# Altium schematic sheet Power.SchDoc
size 863 x 558 mm; SheetNumber: 3; SheetTotal: 6
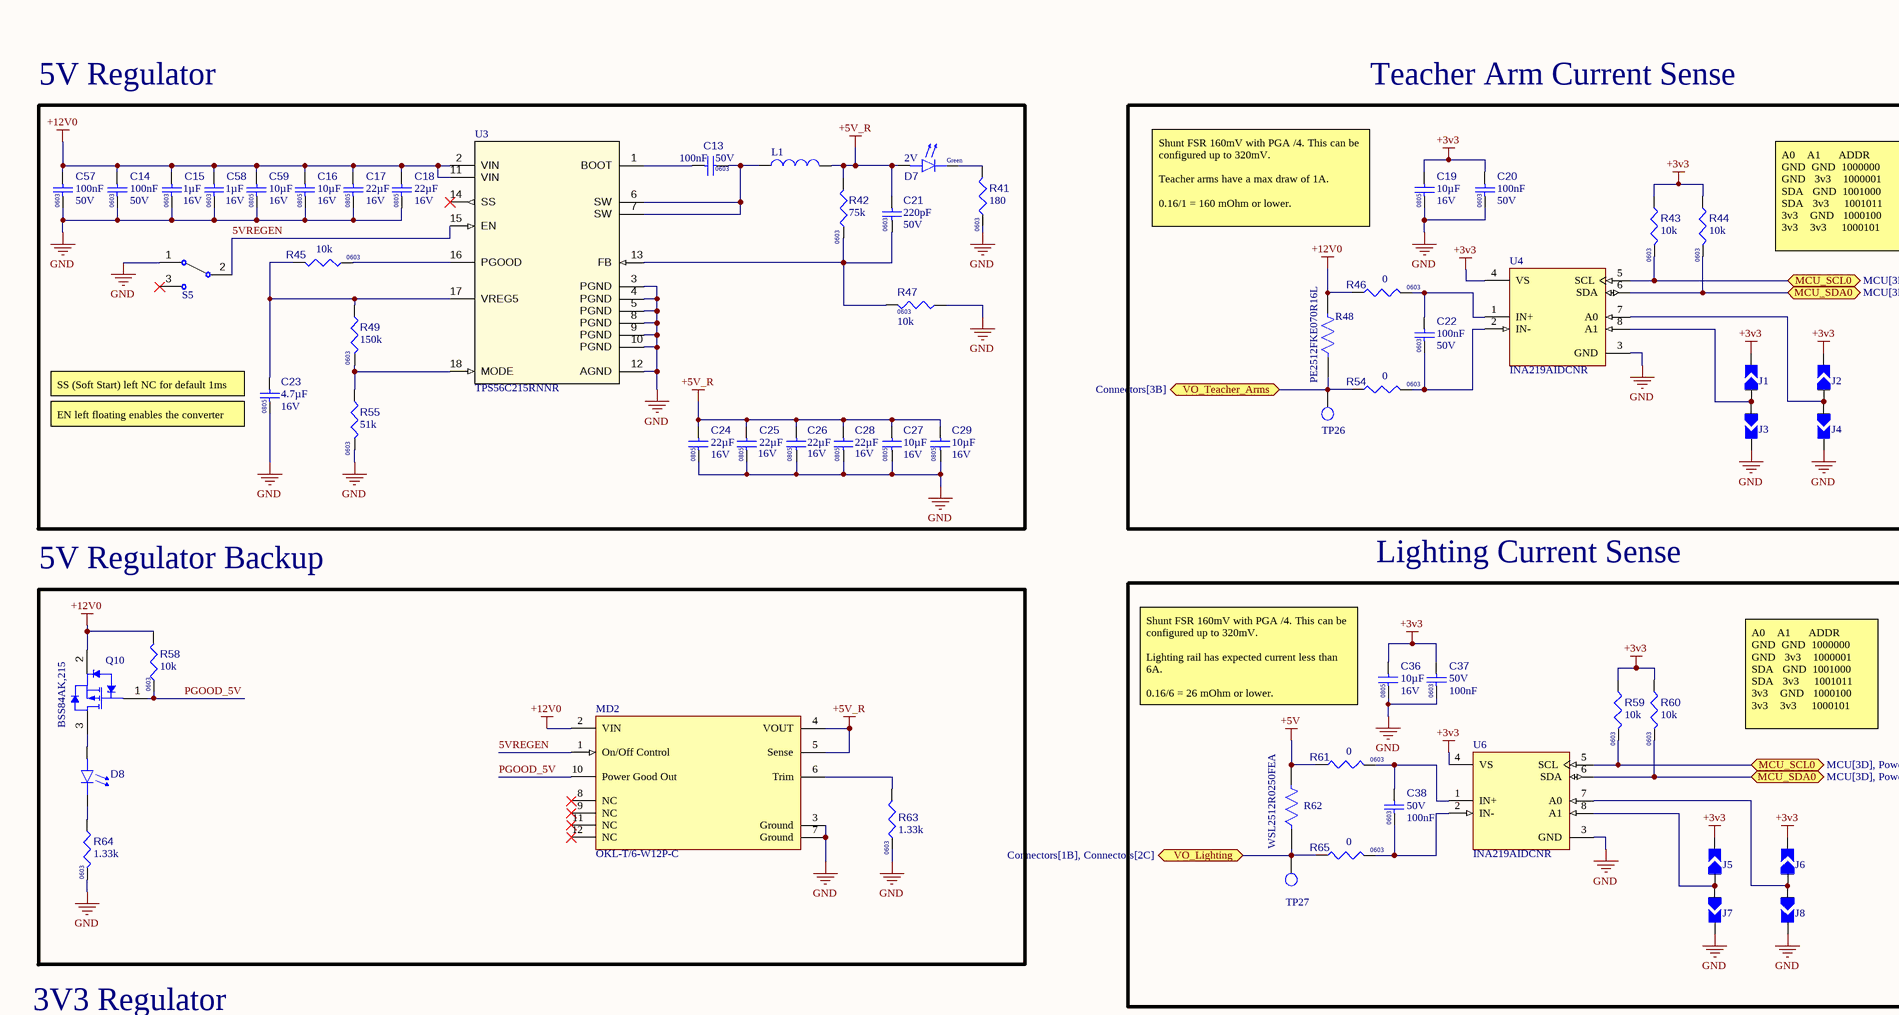
[diagram p0: Power.SchDoc, top left]
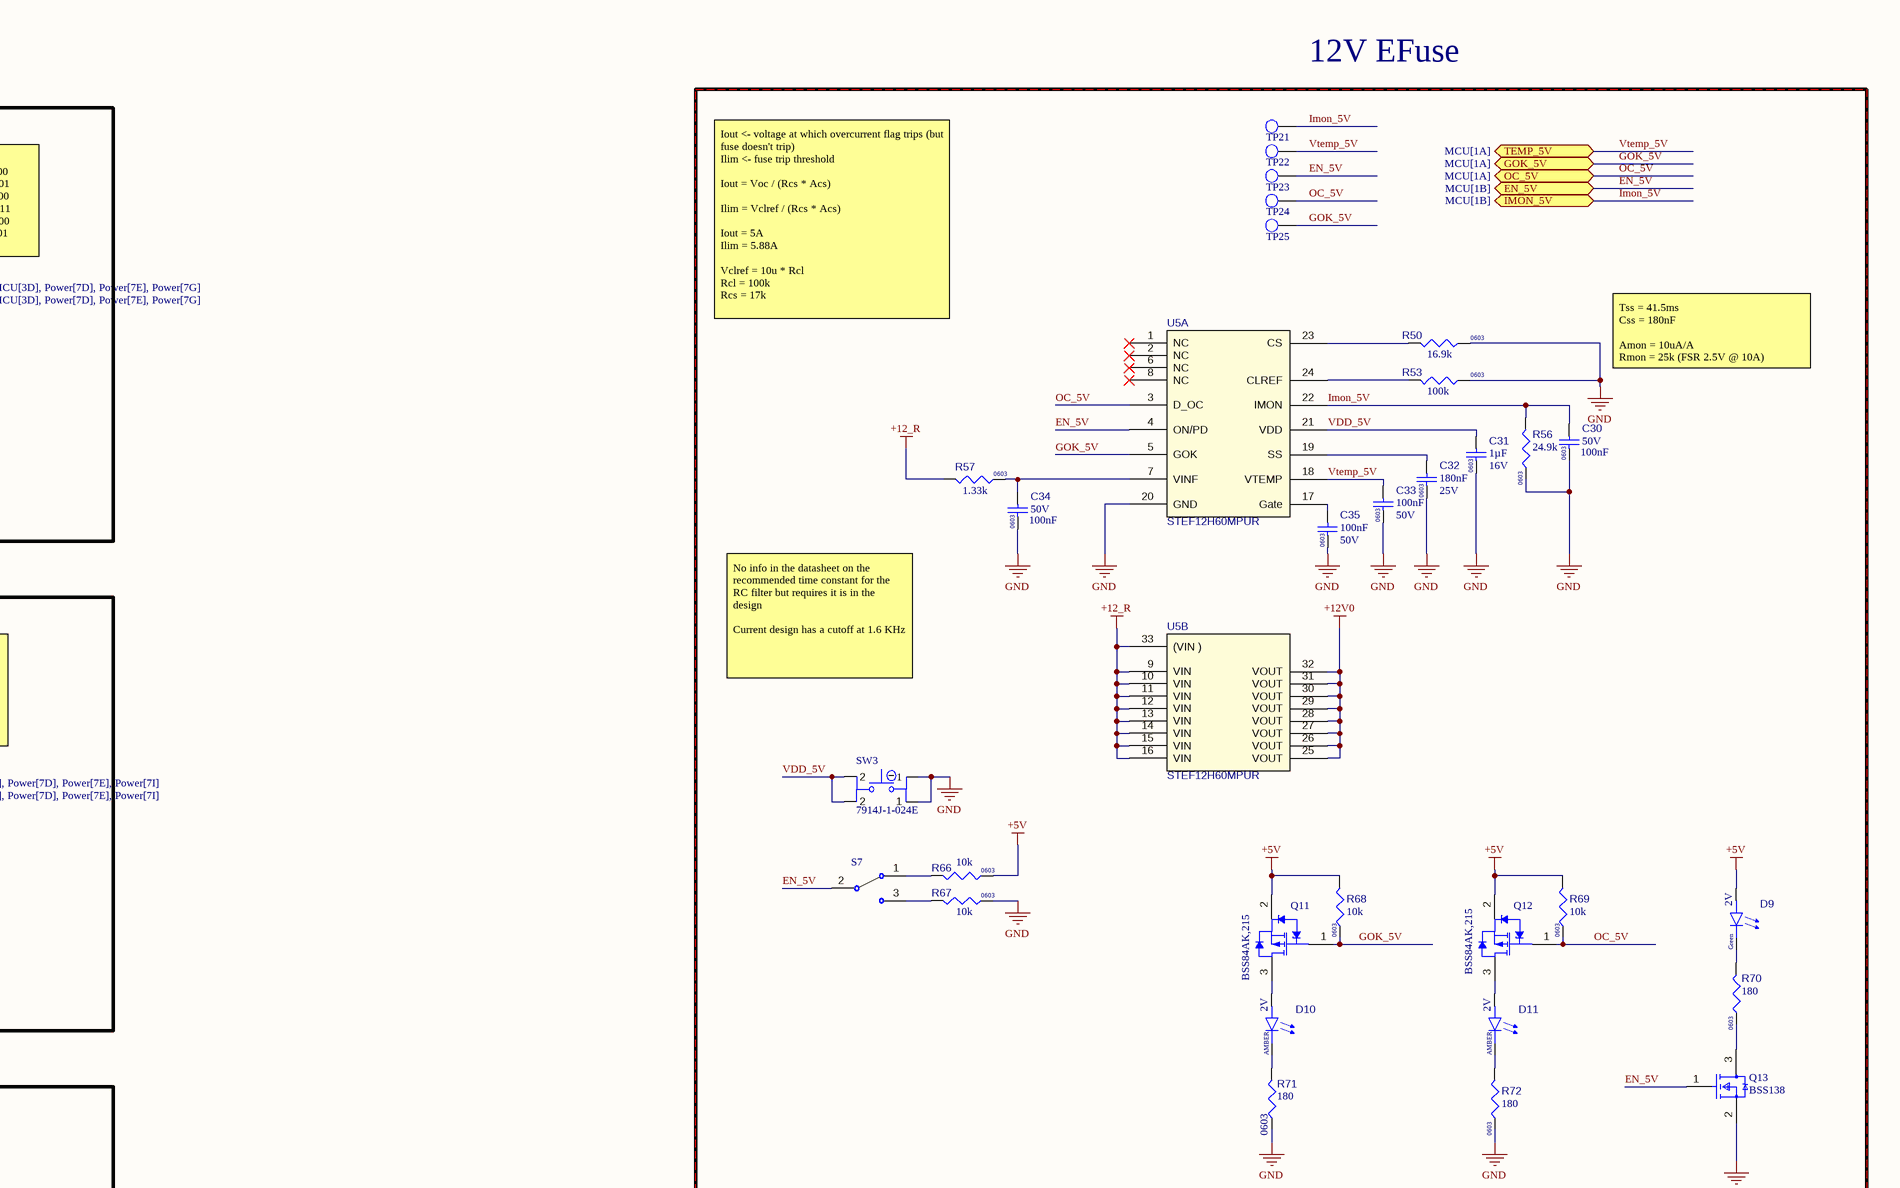
[diagram p1: Power.SchDoc, top right]
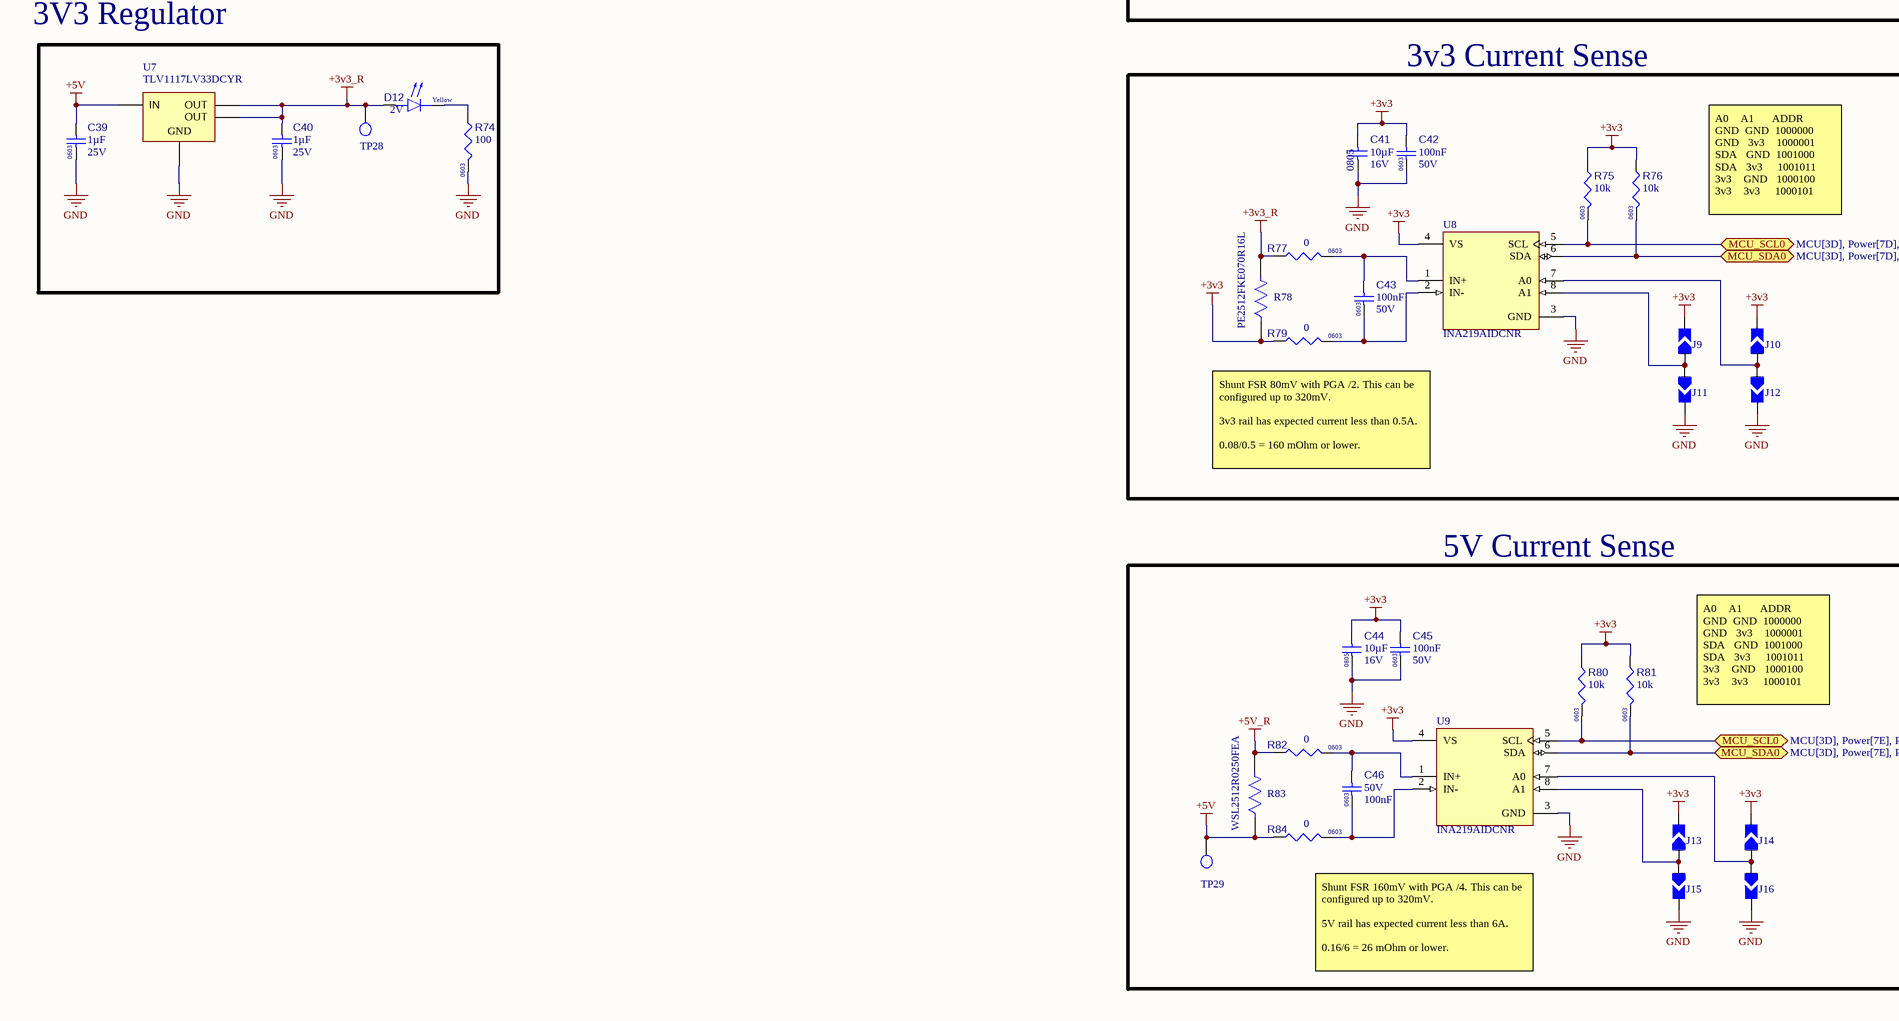
[diagram p2: Power.SchDoc, bottom left]

## Parts
C13  value 100nF  Voltage Rating: 50V  Case/Package: 0603  [CAPC1608X90X40NL10T20]  (hidden comment: Capacitor 100 nF +/-10% 50 V 0603)
C14  value 100nF  Voltage Rating: 50V  Case/Package: 0603  [CAPC1608X90X40NL10T20]  (hidden comment: Capacitor 100 nF +/-10% 50 V 0603)
C15  value 1µF  Case/Package: 0603  Voltage Rating: 16V  [CAPC1608X90X35NL15T15]  (hidden comment: Capacitor 1uF +/- 10% 16V 0603)
C16  value 10µF  Voltage Rating: 16V  Case/Package: 0805  [CAP CER 10UF 16V X5R 0805-Footprint-1]  (hidden comment: CAP CER 10UF 16V X5R 0805)
C17  value 22µF  Voltage Rating: 16V  Case/Package: 0805  [CL21A226MOQNNNE-Footprint-1]  (hidden comment: CL21A226MOQNNNE)
C18  value 22µF  Voltage Rating: 16V  Case/Package: 0805  [CL21A226MOQNNNE-Footprint-1]  (hidden comment: CL21A226MOQNNNE)
C19  value 10µF  Voltage Rating: 16V  Case/Package: 0805  [CAP CER 10UF 16V X5R 0805-Footprint-1]  (hidden comment: CAP CER 10UF 16V X5R 0805)
C20  value 100nF  Voltage Rating: 50V  Case/Package: 0603  [CAPC1608X90X40NL10T20]  (hidden comment: Capacitor 100 nF +/-10% 50 V 0603)
C21  value 220pF  Rated DC Voltage (URdc): 50V  Case/Package: 0603  [FP-CL10-IPC_B]  (hidden comment: CL10C221JB8NNNC)
C22  value 100nF  Voltage Rating: 50V  Case/Package: 0603  [CAPC1608X90X40NL10T20]  (hidden comment: Capacitor 100 nF +/-10% 50 V 0603)
C23  value 4.7µF  Case/Package: 0805  Rated DC Voltage (URdc): 16V  [CL21A475KOFNNNE-Footprint-1]  (hidden comment: CL21A475KOFNNNE)
C24  value 22µF  Voltage Rating: 16V  Case/Package: 0805  [CL21A226MOQNNNE-Footprint-1]  (hidden comment: CL21A226MOQNNNE)
C25  value 22µF  Voltage Rating: 16V  Case/Package: 0805  [CL21A226MOQNNNE-Footprint-1]  (hidden comment: CL21A226MOQNNNE)
C26  value 22µF  Voltage Rating: 16V  Case/Package: 0805  [CL21A226MOQNNNE-Footprint-1]  (hidden comment: CL21A226MOQNNNE)
C27  value 10µF  Voltage Rating: 16V  Case/Package: 0805  [CAP CER 10UF 16V X5R 0805-Footprint-1]  (hidden comment: CAP CER 10UF 16V X5R 0805)
C28  value 22µF  Voltage Rating: 16V  Case/Package: 0805  [CL21A226MOQNNNE-Footprint-1]  (hidden comment: CL21A226MOQNNNE)
C29  value 10µF  Voltage Rating: 16V  Case/Package: 0805  [CAP CER 10UF 16V X5R 0805-Footprint-1]  (hidden comment: CAP CER 10UF 16V X5R 0805)
C30  value 100nF  Voltage Rating: 50V  Case/Package: 0603  [CAPC1608X90X40NL10T20]  (hidden comment: Capacitor 100 nF +/-10% 50 V 0603)
C31  value 1µF  Case/Package: 0603  Voltage Rating: 16V  [CAPC1608X90X35NL15T15]  (hidden comment: Capacitor 1uF +/- 10% 16V 0603)
C32  value 180nF  Case/Package: 0603  Rated DC Voltage (URdc): 25V  [FP-GCM188-0_1-IPC_C]  (hidden comment: GCM188R71E184KA55D)
C33  value 100nF  Voltage Rating: 50V  Case/Package: 0603  [CAPC1608X90X40NL10T20]  (hidden comment: Capacitor 100 nF +/-10% 50 V 0603)
C34  value 100nF  Voltage Rating: 50V  Case/Package: 0603  [CAPC1608X90X40NL10T20]  (hidden comment: Capacitor 100 nF +/-10% 50 V 0603)
C35  value 100nF  Voltage Rating: 50V  Case/Package: 0603  [CAPC1608X90X40NL10T20]  (hidden comment: Capacitor 100 nF +/-10% 50 V 0603)
C36  value 10µF  Voltage Rating: 16V  Case/Package: 0805  [CAP CER 10UF 16V X5R 0805-Footprint-1]  (hidden comment: CAP CER 10UF 16V X5R 0805)
C37  value 100nF  Voltage Rating: 50V  Case/Package: 0603  [CAPC1608X90X40NL10T20]  (hidden comment: Capacitor 100 nF +/-10% 50 V 0603)
C38  value 100nF  Voltage Rating: 50V  Case/Package: 0603  [CAPC1608X90X40NL10T20]  (hidden comment: Capacitor 100 nF +/-10% 50 V 0603)
C39  value 1µF  Rated DC Voltage (URdc): 25V  Case/Package: 0603  [FP-CL10-IPC_B]  (hidden comment: CL10B105KA8NNNC)
C40  value 1µF  Rated DC Voltage (URdc): 25V  Case/Package: 0603  [FP-CL10-IPC_B]  (hidden comment: CL10B105KA8NNNC)
C41  value 10µF  Voltage Rating: 16V  Case/Package: 0805  [CAP CER 10UF 16V X5R 0805-Footprint-1]  (hidden comment: CAP CER 10UF 16V X5R 0805)
C42  value 100nF  Voltage Rating: 50V  Case/Package: 0603  [CAPC1608X90X40NL10T20]  (hidden comment: Capacitor 100 nF +/-10% 50 V 0603)
C43  value 100nF  Voltage Rating: 50V  Case/Package: 0603  [CAPC1608X90X40NL10T20]  (hidden comment: Capacitor 100 nF +/-10% 50 V 0603)
C44  value 10µF  Voltage Rating: 16V  Case/Package: 0805  [CAP CER 10UF 16V X5R 0805-Footprint-1]  (hidden comment: CAP CER 10UF 16V X5R 0805)
C45  value 100nF  Voltage Rating: 50V  Case/Package: 0603  [CAPC1608X90X40NL10T20]  (hidden comment: Capacitor 100 nF +/-10% 50 V 0603)
C46  value 100nF  Voltage Rating: 50V  Case/Package: 0603  [CAPC1608X90X40NL10T20]  (hidden comment: Capacitor 100 nF +/-10% 50 V 0603)
C57  value 100nF  Voltage Rating: 50V  Case/Package: 0603  [CAPC1608X90X40NL10T20]  (hidden comment: Capacitor 100 nF +/-10% 50 V 0603)
C58  value 1µF  Case/Package: 0603  Voltage Rating: 16V  [CAPC1608X90X35NL15T15]  (hidden comment: Capacitor 1uF +/- 10% 16V 0603)
C59  value 10µF  Voltage Rating: 16V  Case/Package: 0805  [CAP CER 10UF 16V X5R 0805-Footprint-1]  (hidden comment: CAP CER 10UF 16V X5R 0805)
D7  Forward Voltage: 2V  Color: Green  [WL-SMCW_0603_150060xx75000]  (hidden comment: 150060VS75000)
D8  150060RS75000  [WL-SMCW_0603_150060xx75000]  (value not drawn)
D9  Forward Voltage: 2V  Color: Green  [WL-SMCW_0603_150060xx75000]  (hidden comment: 150060VS75000)
D10  Forward Voltage: 2V  Colour: AMBER  [WL-SMCW_0603_150060xx75000]  (hidden comment: 150060AS75000)
D11  Forward Voltage: 2V  Colour: AMBER  [WL-SMCW_0603_150060xx75000]  (hidden comment: 150060AS75000)
D12  Forward Voltage: 2V  Color: Yellow  [WL-SMCW_0603_150060xx75000]  (hidden comment: 150060YS75000)
J1  Solder jumper  [New footprint 1]  (value not drawn)
J2  Solder jumper  [New footprint 1]  (value not drawn)
J3  Solder jumper  [New footprint 1]  (value not drawn)
J4  Solder jumper  [New footprint 1]  (value not drawn)
J5  Solder jumper  [New footprint 1]  (value not drawn)
J6  Solder jumper  [New footprint 1]  (value not drawn)
J7  Solder jumper  [New footprint 1]  (value not drawn)
J8  Solder jumper  [New footprint 1]  (value not drawn)
J9  Solder jumper  [New footprint 1]  (value not drawn)
J10  Solder jumper  [New footprint 1]  (value not drawn)
J11  Solder jumper  [New footprint 1]  (value not drawn)
J12  Solder jumper  [New footprint 1]  (value not drawn)
J13  Solder jumper  [New footprint 1]  (value not drawn)
J14  Solder jumper  [New footprint 1]  (value not drawn)
J15  Solder jumper  [New footprint 1]  (value not drawn)
J16  Solder jumper  [New footprint 1]  (value not drawn)
L1  744325330  [WE-HCI_1050]  (value not drawn)
MD2  OKL-T/6-W12P-C  [FP-OKL-T-6-W12-MFG]
Q10  BSS84AK,215  [NXP-SOT23_N]
Q11  BSS84AK,215  [NXP-SOT23_N]
Q12  BSS84AK,215  [NXP-SOT23_N]
Q13  BSS138  [FP-318-08-IPC_B]
R41  value 180  Case/Package: 0603  [RESC0603(1608)_N]  (hidden comment: RC0603JR-07180RL)
R42  value 75k  Case/Package: 0603  [RC0603JR-0720KL-Footprint-1]  (hidden comment: RC0603FR-0775KL)
R43  value 10k  Case/Package: 0603  [RESC1608X55X25NL10T15]  (hidden comment: Resistor 10k +/-1% 0603 100 mW)
R44  value 10k  Case/Package: 0603  [RESC1608X55X25NL10T15]  (hidden comment: Resistor 10k +/-1% 0603 100 mW)
R45  value 10k  Case/Package: 0603  [RESC1608X55X25NL10T15]  (hidden comment: Resistor 10k +/-1% 0603 100 mW)
R46  value 0  Case/Package: 0603  [RC0603JR-0720KL-Footprint-1]  (hidden comment: RC0603JR-070RL)
R47  value 10k  Case/Package: 0603  [RESC1608X55X25NL10T15]  (hidden comment: Resistor 10k +/-1% 0603 100 mW)
R48  PE2512FKE070R16L  [FP-WSL2512-0_762-IPC_B]
R49  value 150k  Case/Package: 0603  [RC0603JR-0720KL-Footprint-1]  (hidden comment: RC0603FR-13150KL)
R50  value 16.9k  Case/Package: 0603  [RESC1608X55X25NL10T15]  (hidden comment: RC0603FR-0716K9L)
R53  value 100k  Case/Package: 0603  [RESC1608X55X25NL10T15]  (hidden comment: RC0603FR-07100KL)
R54  value 0  Case/Package: 0603  [RC0603JR-0720KL-Footprint-1]  (hidden comment: RC0603JR-070RL)
R55  value 51k  Case/Package: 0603  [RC0603JR-0720KL-Footprint-1]  (hidden comment: RC0603FR-0751KL)
R56  value 24.9k  Case/Package: 0603  [RESC1608X55X25NL10T15]  (hidden comment: RC0603FR-1024K9L)
R57  value 1.33k  Case/Package: 0603  [RESC1608X55X25NL10T15]  (hidden comment: RC0603FR-071K33L)
R58  value 10k  Case/Package: 0603  [RESC1608X55X25NL10T15]  (hidden comment: Resistor 10k +/-1% 0603 100 mW)
R59  value 10k  Case/Package: 0603  [RESC1608X55X25NL10T15]  (hidden comment: Resistor 10k +/-1% 0603 100 mW)
R60  value 10k  Case/Package: 0603  [RESC1608X55X25NL10T15]  (hidden comment: Resistor 10k +/-1% 0603 100 mW)
R61  value 0  Case/Package: 0603  [RC0603JR-0720KL-Footprint-1]  (hidden comment: RC0603JR-070RL)
R62  WSL2512R0250FEA  [FP-WSL2512-0_762-IPC_B]
R63  value 1.33k  Case/Package: 0603  [RESC1608X55X25NL10T15]  (hidden comment: RC0603FR-071K33L)
R64  value 1.33k  Case/Package: 0603  [RESC1608X55X25NL10T15]  (hidden comment: RC0603FR-071K33L)
R65  value 0  Case/Package: 0603  [RC0603JR-0720KL-Footprint-1]  (hidden comment: RC0603JR-070RL)
R66  value 10k  Case/Package: 0603  [RESC1608X55X25NL10T15]  (hidden comment: Resistor 10k +/-1% 0603 100 mW)
R67  value 10k  Case/Package: 0603  [RESC1608X55X25NL10T15]  (hidden comment: Resistor 10k +/-1% 0603 100 mW)
R68  value 10k  Case/Package: 0603  [RESC1608X55X25NL10T15]  (hidden comment: Resistor 10k +/-1% 0603 100 mW)
R69  value 10k  Case/Package: 0603  [RESC1608X55X25NL10T15]  (hidden comment: Resistor 10k +/-1% 0603 100 mW)
R70  value 180  Case/Package: 0603  [RESC0603(1608)_N]  (hidden comment: RC0603JR-07180RL)
R71  value 180  Case/Package: 0603  [RESC0603(1608)_N]  (hidden comment: RC0603JR-07180RL)
R72  value 180  Case/Package: 0603  [RESC0603(1608)_N]  (hidden comment: RC0603JR-07180RL)
R74  value 100  Case/Package: 0603  [RC0603JR-0720KL-Footprint-1]  (hidden comment: RC0603FR-07100RL)
R75  value 10k  Case/Package: 0603  [RESC1608X55X25NL10T15]  (hidden comment: Resistor 10k +/-1% 0603 100 mW)
R76  value 10k  Case/Package: 0603  [RESC1608X55X25NL10T15]  (hidden comment: Resistor 10k +/-1% 0603 100 mW)
R77  value 0  Case/Package: 0603  [RC0603JR-0720KL-Footprint-1]  (hidden comment: RC0603JR-070RL)
R78  PE2512FKE070R16L  [FP-WSL2512-0_762-IPC_B]
R79  value 0  Case/Package: 0603  [RC0603JR-0720KL-Footprint-1]  (hidden comment: RC0603JR-070RL)
R80  value 10k  Case/Package: 0603  [RESC1608X55X25NL10T15]  (hidden comment: Resistor 10k +/-1% 0603 100 mW)
R81  value 10k  Case/Package: 0603  [RESC1608X55X25NL10T15]  (hidden comment: Resistor 10k +/-1% 0603 100 mW)
R82  value 0  Case/Package: 0603  [RC0603JR-0720KL-Footprint-1]  (hidden comment: RC0603JR-070RL)
R83  WSL2512R0250FEA  [FP-WSL2512-0_762-IPC_B]
R84  value 0  Case/Package: 0603  [RC0603JR-0720KL-Footprint-1]  (hidden comment: RC0603JR-070RL)
S5  SLW-883935-2A-D  [SLW-883935-2A-D-Footprint-1]  (value not drawn)
S7  SLW-883935-2A-D  [SLW-883935-2A-D-Footprint-1]  (value not drawn)
SW3  7914J-1-024E  [FP-7914J-1-024E-MFG]
TP21  RCUCTE  [FP-S2761-46R-MFG]  (value not drawn)
TP22  RCUCTE  [FP-S2761-46R-MFG]  (value not drawn)
TP23  RCUCTE  [FP-S2761-46R-MFG]  (value not drawn)
TP24  RCUCTE  [FP-S2761-46R-MFG]  (value not drawn)
TP25  RCUCTE  [FP-S2761-46R-MFG]  (value not drawn)
TP26  RCUCTE  [FP-S2761-46R-MFG]  (value not drawn)
TP27  RCUCTE  [FP-S2761-46R-MFG]  (value not drawn)
TP28  RCUCTE  [FP-S2761-46R-MFG]  (value not drawn)
TP29  RCUCTE  [FP-S2761-46R-MFG]  (value not drawn)
U3  TPS56C215RNNR  [TPS56C215RNNR-Footprint-1]
U4  INA219AIDCNR  [FP-DCN0008A-IPC_B]
U5  STEF12H60MPUR  [STEF12H60MPUR-Footprint-1]  (parts A,B of 2)
U6  INA219AIDCNR  [FP-DCN0008A-IPC_B]
U7  TLV1117LV33DCYR  [DCY0004A_L]
U8  INA219AIDCNR  [FP-DCN0008A-IPC_B]
U9  INA219AIDCNR  [FP-DCN0008A-IPC_B]

## Blocks framed on the sheet
5V Regulator: C13-C18 C21 C23-C29 C57-C59 D7 L1 R41 R42 R45 R47 R49 R55 S5 U3
Teacher Arm Current Sense: C19 C20 C22 J1-J4 R43 R44 R46 R48 R54 TP26 U4
5V Regulator Backup: D8 MD2 Q10 R58 R63 R64
Lighting Current Sense: C36-C38 J5-J8 R59-R62 R65 TP27 U6
3v3 Current Sense: C41-C43 J9-J12 R75-R79 U8
5V Current Sense: C44-C46 J13-J16 R80-R84 TP29 U9

## Ports
EN_5V (bidir, see MCU[1B]), GOK_5V (bidir, see MCU[1A]), IMON_5V (bidir, see MCU[1B]), MCU_SCL0 (bidir, see MCU[3D], Power[7D], Power[7E], Power[7G]), MCU_SCL0 (bidir, see MCU[3D], Power[7D], Power[7E], Power[7I]), MCU_SCL0 (bidir, see MCU[3D], Power[7D], Power[7G], Power[7I]), MCU_SCL0 (bidir, see MCU[3D], Power[7E], Power[7G], Power[7I]), MCU_SDA0 (bidir, see MCU[3D], Power[7D], Power[7E], Power[7G]), MCU_SDA0 (bidir, see MCU[3D], Power[7D], Power[7E], Power[7I]), MCU_SDA0 (bidir, see MCU[3D], Power[7D], Power[7G], Power[7I]), MCU_SDA0 (bidir, see MCU[3D], Power[7E], Power[7G], Power[7I]), OC_5V (bidir, see MCU[1A]), TEMP_5V (bidir, see MCU[1A]), VO_Lighting (bidir, see Connectors[1B], Connectors[2C]), VO_Teacher_Arms (bidir, see Connectors[3B])

## Nets
+3v3: C19.2 C20.2 C36.2 C37.2 C41.2 C42.2 C44.2 C45.2 J1.2 J2.2 J5.2 J6.2 J9.2 J10.2 J13.2 J14.2 R43.1 R44.1 R59.1 R60.1 R75.1 R76.1 R78.1 R79.1 R80.1 R81.1 U4.4(VS) U6.4(VS) U8.4(VS) U9.4(VS)
+3v3_R: C40.2 D12.2(A) R77.1 R78.2 TP28.1 U7.2(OUT) U7.4(OUT)
+5V: C39.2 D9.2(A) Q11.2(S) Q12.2(S) R61.1 R62.2 R66.2 R68.2 R69.2 R83.1 R84.1 TP29.1 U7.3(IN)
+5V_R: C21.2 C24.2 C25.2 C26.2 C27.2 C28.2 C29.2 D7.2(A) L1.2 MD2.4(VOUT) MD2.5(Sense) R42.2 R82.1 R83.2
+12_R: R57.2 U5.9(VIN) U5.10(VIN) U5.11(VIN) U5.12(VIN) U5.13(VIN) U5.14(VIN) U5.15(VIN) U5.16(VIN) U5.33((VIN_))
+12V0: C14.2 C15.2 C16.2 C17.2 C18.2 C57.2 C58.2 C59.2 MD2.2(VIN) Q10.2(S) R46.1 R48.2 R58.2 U3.2(VIN) U3.11(VIN) U5.25(VOUT) U5.26(VOUT) U5.27(VOUT) U5.28(VOUT) U5.29(VOUT) U5.30(VOUT) U5.31(VOUT) U5.32(VOUT)
GND: C14.1 C15.1 C16.1 C17.1 C18.1 C19.1 C20.1 C23.1 C24.1 C25.1 C26.1 C27.1 C28.1 C29.1 C30.1 C31.1 C32.1 C33.1 C34.1 C35.1 C36.1 C37.1 C39.1 C40.1 C41.1 C42.1 C44.1 C45.1 C57.1 C58.1 C59.1 J3.2 J4.2 J7.2 J8.2 J11.2 J12.2 J15.2 J16.2 MD2.3(Ground) MD2.7(Ground) Q13.2(S) R41.1 R47.1 R50.1 R53.1 R55.2 R56.1 R63.1 R64.2 R67.1 R71.1 R72.1 R74.2 S5.1(NC) SW3.1 SW3.4(1) U3.3(PGND) U3.4(PGND) U3.5(PGND) U3.8(PGND) U3.9(PGND) U3.10(PGND) U3.12(AGND) U4.3(GND) U5.20(GND) U6.3(GND) U7.1(GND) U8.3(GND) U9.3(GND)
5VREGEN: MD2.1(On/Off_Control) S5.2(COM) U3.15(EN)
EN_5V: Q13.1(G) S7.2(COM) TP23.1 U5.4(ON/PD) ; port EN_5V
GOK_5V: Q11.1(G) R68.1 TP25.1 U5.5(GOK) ; port GOK_5V
Imon_5V: C30.2 R56.2 TP21.1 U5.22(IMON) ; port IMON_5V
MCU_SCL0: R43.2 R59.2 R75.2 R80.2 U4.5(SCL) U6.5(SCL) U8.5(SCL) U9.5(SCL) ; port MCU_SCL0
MCU_SDA0: R44.2 R60.2 R76.2 R81.2 U4.6(SDA) U6.6(SDA) U8.6(SDA) U9.6(SDA) ; port MCU_SDA0
OC_5V: Q12.1(G) R69.1 TP24.1 U5.3(D_OC) ; port OC_5V
PGOOD_5V: MD2.10(Power_Good_Out) Q10.1(G) R58.1
VDD_5V: C31.2 SW3.2 SW3.3(2) U5.21(VDD)
VO_Lighting: R62.1 R65.1 TP27.1 ; port VO_Lighting
VO_Teacher_Arms: R48.1 R54.1 TP26.1 ; port VO_Teacher_Arms
Vtemp_5V: C33.2 TP22.1 U5.18(VTEMP) ; port TEMP_5V
NetC13_1: C13.1 L1.1 U3.6(SW) U3.7(SW)
NetC13_2: C13.2 U3.1(BOOT)
NetC21_1: C21.1 R42.1 R47.2 U3.13(FB)
NetC22_1: C22.1 R54.2 U4.2(IN-)
NetC22_2: C22.2 R46.2 U4.1(IN+)
NetC23_2: C23.2 R45.2 R49.1 U3.17(VREG5)
NetC32_2: C32.2 U5.19(SS)
NetC34_2: C34.2 R57.1 U5.7(VINF)
NetC35_2: C35.2 U5.17(Gate)
NetC38_1: C38.1 R65.2 U6.2(IN-)
NetC38_2: C38.2 R61.2 U6.1(IN+)
NetC43_1: C43.1 R79.2 U8.2(IN-)
NetC43_2: C43.2 R77.2 U8.1(IN+)
NetC46_1: C46.1 R84.2 U9.2(IN-)
NetC46_2: C46.2 R82.2 U9.1(IN+)
NetD7_1: D7.1(K) R41.2
NetD8_1: D8.1(K) R64.1
NetD8_2: D8.2(A) Q10.3(D)
NetD9_1: D9.1(K) R70.2
NetD10_1: D10.1(K) R71.2
NetD10_2: D10.2(A) Q11.3(D)
NetD11_1: D11.1(K) R72.2
NetD11_2: D11.2(A) Q12.3(D)
NetD12_1: D12.1(K) R74.1
NetJ1_1: J1.1 J3.1 U4.8(A1)
NetJ2_1: J2.1 J4.1 U4.7(A0)
NetJ5_1: J5.1 J7.1 U6.8(A1)
NetJ6_1: J6.1 J8.1 U6.7(A0)
NetJ9_1: J9.1 J11.1 U8.8(A1)
NetJ10_1: J10.1 J12.1 U8.7(A0)
NetJ13_1: J13.1 J15.1 U9.8(A1)
NetJ14_1: J14.1 J16.1 U9.7(A0)
NetMD2_6: MD2.6(Trim) R63.2
NetQ13_3: Q13.3(D) R70.1
NetR45_1: R45.1 U3.16(PGOOD)
NetR49_2: R49.2 R55.1 U3.18(MODE)
NetR50_2: R50.2 U5.23(CS)
NetR53_2: R53.2 U5.24(CLREF)
NetR66_1: R66.1 S7.1(NC)
NetR67_2: R67.2 S7.3(NO)

Not connected (* = marked no-connect by the designer): MD2 8(NC)* 9(NC)* 11(NC)* 12(NC)*; S5 3(NO)*; U3 14(SS)*; U5 1(NC)* 2(NC)* 6(NC)* 8(NC)*

## Layout directives
mark named EFUSE_12V: +5V, +12_R, +12V0, EN_5V, GND, GOK_5V, Imon_5V, OC_5V, VDD_5V, Vtemp_5V

## Notes on the sheet
- 12V EFuse
- Shunt FSR 160mV with PGA /4. This can be configured up to 320mV.
  Teacher arms have a max draw of 1A.
  0.16/1 = 160 mOhm or lower.
- A0    A1      ADDR
  GND  GND  1000000
  GND   3v3    1000001
  SDA   GND  1001000
  SDA   3v3     1001011
  3v3    GND   1000100
  3v3    3v3     1000101
- Iout <- voltage at which overcurrent flag trips (but fuse doesn't trip)
  Ilim <- fuse trip threshold
  Iout = Voc / (Rcs * Acs)
  Ilim = Vclref / (Rcs * Acs)
  Iout = 5A
  Ilim = 5.88A
  Vclref = 10u * Rcl
  Rcl = 100k
  Rcs = 17k
- (near C23) SS (Soft Start) left NC for default 1ms
- Tss = 41.5ms
  Css = 180nF
  Amon = 10uA/A
  Rmon = 25k (FSR 2.5V @ 10A)
- (near C23) EN left floating enables the converter
- (near C36) Shunt FSR 160mV with PGA /4. This can be configured up to 320mV.
  Lighting rail has expected current less than 6A.
  0.16/6 = 26 mOhm or lower.
- No info in the datasheet on the recommended time constant for the RC filter but requires it is in the design
  Current design has a cutoff at 1.6 KHz
- 3V3 Regulator
- (near R79) Shunt FSR 80mV with PGA /2. This can be configured up to 320mV.
  3v3 rail has expected current less than 0.5A.
  0.08/0.5 = 160 mOhm or lower.
- (near R84) Shunt FSR 160mV with PGA /4. This can be configured up to 320mV.
  5V rail has expected current less than 6A.
  0.16/6 = 26 mOhm or lower.
- DWG. NO.
- REV.
- SHT.
- REVISION
- DESCRIPTION
- DATE
- APPROVED
- THIS DOCUMENT AND THE DATA DISCLOSED HEREIN OR HEREWITH IS THE PROPERTY OF ALTIUM LIMITED AND MAY BE FREELY DISTRIBUTED IN WHOLE. NO RIGHTS ARE RESERVED OR EXPRESS OR IMPLIED WARANTEE GIVEN.
- ENG:
- DSN:
- APPROVALS
- PROJECT
- DOCUMENT REVISION:
- DESIGN ITEM:
- CHK:
- BOM:
- REFERENCE DOCUMENTS
- PROJECT REVISION:
- TITLE
- FAB DWG:
- PCB DWG:
- ASSY DWG:
- SCALE:
- SIZE
- D
- CAGE CODE
- FILE NAME
- DWG NO.
- SHEET
- OF
- REV

## Library data of the parts
C13 C14 C20 C22 C30 C33-C35 C37 C38 C42 C43 C45 C46 C57 = CMP-001-00017-8: Chip Capacitor, 100 nF, +/- 10%, 50 V, 0603 (1608 Metric); Capacitor Type: Ceramic; Tolerance: 10%; Mounting Technology: SM; Max Operating Temperature: 125°C; RoHS Compliant: True; Pins: 2; Min Operating Temperature: -55°C
C15 C31 C58 = CMP-001-00004-8: Chip Capacitor, 1 uF, +/- 10%, 16 V, 0603 (1608 Metric); Capacitor Type: Ceramic; Mounting Technology: SM; RoHS Compliant: True; Min Operating Temperature: -55°C; Pins: 2; Max Operating Temperature: 125°C; Tolerance: 10%
C16 C19 C27 C29 C36 C41 C44 C59 = CMP-001-00084-6: Ceramic Capacitor, Multilayer, Ceramic, 16V, 10% +Tol, 10% -Tol, X5R, 15% TC, 10uF, Surface Mount, 0805; Pins: 2; Capacitor Type: Ceramic; Max Operating Temperature: 85°C; Min Operating Temperature: -55°C; RoHS Compliant: Yes; Mounting Technology: Surface Mount
C17 C18 C24-C26 C28 = CMP-001-00087-3: Ceramic Capacitor, Multilayer, Ceramic, 16V, 20% +Tol, 20% -Tol, X5R, 15% TC, 22uF, Surface Mount, 0805; Min Operating Temperature: -55°C; Mounting Technology: Surface Mount; Max Operating Temperature: 85°C; Capacitor Type: Ceramic; Pins: 2; RoHS Compliant: Yes
C21 = CMP-001-00090-1: Ceramic Capacitor, Multilayer, Ceramic, 50V, 5% +Tol, 5% -Tol, C0G, -/+30ppm/Cel TC, 0.00022uF, Surface Mount, 0603; Multilayer: Yes; Width: 0.8mm; Min Operating Temperature: -55°C; Package Shape: Rectangular; RoHS Compliant: Yes; Pins: 2; Capacitor Type: Ceramic; Length: 1.6mm; Reach SVHC Compliant: Yes; Tolerance (fill in as +-): 5%; Dielectric Material: Ceramic; Max Operating Temperature: 125°C; Packaging: Tape and Reel; JESD-609 Code: e3; Termination: Wraparound; Terminal Finish: Nickel; Package Style: SMTMeter; Temperature Characteristics Code: C0G; Tolerance  (fill in as +-): 5%; Height: 0.9mm; Mounting Technology: Surface Mount
C23 = CMP-001-00089-2: Ceramic Capacitor, Multilayer, Ceramic, 16V, 10% +Tol, 10% -Tol, X5R, 15% TC, 4.7uF, Surface Mount, 0805; Multilayer: Yes; Dielectric Material: Ceramic; Tolerance (fill in as +-): 10%; Pins: 2; Package Style: SMTMeter; Max Operating Temperature: 85°C; JESD-609 Code: e3; Termination: Wraparound; Min Operating Temperature: -55°C; RoHS Compliant: Yes; Mounting Technology: Surface Mount; Reach SVHC Compliant: Yes; Terminal Finish: Nickel; Packaging: Tape and Reel; Capacitor Type: Ceramic; Height: 1.35mm; Width: 1.25mm; Temperature Characteristics Code: X5R; Length: 2mm; Tolerance  (fill in as +-): 10%; Package Shape: Rectangular
C32 = CMP-001-00098-1: Ceramic Capacitor, Multilayer, Ceramic, 25V, 10% +Tol, 10% -Tol, X7R, 15% TC, 0.18uF, Surface Mount, 0603; Reference Standard: AEC-Q200; Multilayer: Yes; Tolerance  (fill in as +-): 10%; JESD-609 Code: e3; Dielectric Material: Ceramic; RoHS Compliant: Yes; Terminal Finish: Nickel; Capacitor Type: Ceramic; Max Operating Temperature: 125°C; Temperature Characteristics Code: X7R; Tolerance (fill in as +-): 10%; Pins: 2; Min Operating Temperature: -55°C; Height: 0.8mm; Packaging: Tape and Reel; Mounting Technology: Surface Mount; Package Shape: Rectangular; Width: 0.8mm; Package Style: SMTMeter; Reach SVHC Compliant: Yes; Termination: Wraparound; Length: 1.6mm
C39 C40 = CMP-001-00088-1: Ceramic Capacitor, Multilayer, Ceramic, 25V, 10% +Tol, 10% -Tol, X7R, 15% TC, 1uF, Surface Mount, 0603; Multilayer: Yes; RoHS Compliant: Yes; Length: 1.6mm; Packaging: Tape and Reel; Capacitor Type: Ceramic; Width: 0.8mm; Min Operating Temperature: -55°C; Termination: Wraparound; Tolerance (fill in as +-): 10%; JESD-609 Code: e3; Package Style: SMTMeter; Dielectric Material: Ceramic; Temperature Characteristics Code: X7R; Pins: 2; Reach SVHC Compliant: Yes; Mounting Technology: Surface Mount; Height: 0.9mm; Terminal Finish: Nickel; Package Shape: Rectangular; Tolerance  (fill in as +-): 10%; Max Operating Temperature: 125°C
D7 D9 = CMP-007-00045-1: Single Color LED, Bright Green, Water Clear, 1.1mm; Viewing Angle: 140°; Shape: Rectangular; Overall Height: 0.7mm; Forward Current: 30mA; Channels: 1; Luminous Intensity-Nom: 40mcd; Size: 1.1mm; Pins: 2; Optoelectronic Device Type: SINGLE COLOR LED; Mounting Technology: Surface Mount; Min Operating Temperature: -40°C; RoHS Compliant: Yes; Lens Style: WATER CLEAR; Max Operating Temperature: 85°C; Reach SVHC Compliant: Yes; Packaging: Tape and Reel; Terminal Pitch: 1.6mm
D8 = CMP-007-00036-1: Single Color LED, Red, Water Clear, 1.1mm; Forward Current: 30mA; Max Operating Temperature: 85°C; Mounting Technology: Surface Mount; RoHS Compliant: Yes; Pins: 2; Min Operating Temperature: -40°C
D10 D11 = CMP-007-00044-3: Single Color LED, Amber, Water Clear, 1.1mm; Overall Height: 0.7mm; Viewing Angle: 140°; Channels: 1; Luminous Intensity-Nom: 430mcd; Shape: Rectangular; Forward Current: 30mA; Min Operating Temperature: -40°C; Optoelectronic Device Type: SINGLE COLOR LED; Mounting Technology: Surface Mount; Terminal Pitch: 1.6mm; Packaging: Tape and Reel; Pins: 2; RoHS Compliant: Yes; Max Operating Temperature: 85°C; Lens Style: WATER CLEAR; Reach SVHC Compliant: Yes; Size: 1.1mm
D12 = CMP-007-00046-1: Single Color LED, Yellow, Water Clear, 1.1mm; Shape: Rectangular; Forward Current: 30mA; Viewing Angle: 140°; Channels: 1; Luminous Intensity-Nom: 120mcd; Overall Height: 0.7mm; Packaging: Tape and Reel; Size: 1.1mm; Max Operating Temperature: 85°C; RoHS Compliant: Yes; Pins: 2; Lens Style: WATER CLEAR; Reach SVHC Compliant: Yes; Terminal Pitch: 1.6mm; Mounting Technology: Surface Mount; Min Operating Temperature: -40°C; Optoelectronic Device Type: SINGLE COLOR LED
J1-J16 = CMP-00030-00001-3
L1 = CMP-006-00026-1: General Purpose Inductor, 3.3uH, 20%, 1 Element, SMD, 4140; Package Length: 10.5mm; Inductor Application: POWER INDUCTOR; Shape/Size Description: RECTANGULAR PACKAGE; Channels: 1; Max Current Rating: 12A; DC Resistance (DCR): 5.9mR; Case/Size Code: 4140; Package Height: 4.7mm; Test Frequency: 100kHz; Shielding: Unshielded; Package Width: 10.2mm; Self Resonant Frequency: 54MHz; Pins: 2; Series: 744325330; Inductor Type: GENERAL PURPOSE INDUCTOR; Surface Mount: Yes; Construction: Magnetically Shielded; Max Operating Temperature: 150°C; Tolerance: 20%; Manufacturer Series: 744325330; Min Operating Temperature: -40°C; Inductance-Nom (L): 3.3uH; Terminal Finish: Copper; Reach SVHC Compliant: Yes; Packaging: Tape and Reel; Package Style: SMTMeter; Termination: Wraparound; Terminal Placement: Dual Ended; RoHS Compliant: Yes
MD2 = CMP-20596-000059-1: DC DC CONVERTER 0.591-5.5V 30W; Efficiency: 93%; Voltage - Output 1: 5.5V; Nominal Input Voltage: 12V; Min Input Voltage: 4.5V; Max Output Current: 6A; Number of Outputs: 1; Max Input Voltage: 14V; Output Power: 30W; Height: 0.28inch; Series: Okami™ OKL-T/6-W12; Length: 0.48inch; Features: UVLO; Mount: Surface Mount; Case/Package: LGA; Number of Pins: 12; Max Operating Temperature: 85°C; RoHS Compliant: Yes; Packaging: Tape and Reel; Max Power Dissipation: 30W; Width: 0.48inch; Current - Output 1: 6A; Output Current: 6A; Output Voltage: 5.5V; Min Operating Temperature: -40°C
Q10-Q12 = CMP-1259-00086-1: P-Channel Trench MOSFET, -50 V, -0.18 A, -55 to 150 degC, 3-Pin SOT23, Tape and Reel; Manufacturer: NXP Semiconductors; Automotive Qualified: Y; Packing: Tape & Reel; Channel Type: P; VGSth [typ] (V): -1.6; IDM [max] (A): -0.7; Code_JEDEC: TO-236AB; DatasheetVersion: Rev. 1; ID [max] (A): -0.18; Mounting Technology: Surface Mount; ComponentLink3URL: http://www.nxp.com/documents/outline_drawing/sot023_po.pdf; ComponentLink1Description: Manufacturer URL; PackageVersion: 06-03-16, 03/2006; ComponentLink2Description: Datasheet; PackageReference: SOT23; VDS [max] (V): -50; PackageDescription: 3-Pin Small Outline Transistor Package, Body 2.9 x 1.3 mm, Pitch 0.95 mm; ComponentLink2URL: http://www.nxp.com/documents/data_sheet/BSS84AK.pdf; ComponentLink3Description: Package Specification; ComponentLink1URL: http://www.nxp.com/; PartNumber: BSS84AK,215
Q13 = CMP-07173-000101-1: MOSFET N-CH 50V 220MA SOT-23; Turn-Off Delay Time: 20ns; Element Configuration: Single; Rds On Max: 3.5R; Gate to Source Voltage (Vgs): 20V; Threshold Voltage: 1.3V; Number of Elements: 1; Power Dissipation: 360mW; Rise Time: 9ns; Turn-On Delay Time: 2.5ns; Input Capacitance: 27pF; On-State Resistance: 6R; Lead Free: Lead Free; Length: 2.92mm; Width: 1.3mm; Drain to Source Breakdown Voltage: 50V; Min Operating Temperature: -55°C; REACH SVHC: No SVHC; Packaging: Tape and Reel; Radiation Hardening: No; Height: 0.93mm; Drain to Source Voltage (Vdss): 50V; Current Rating: 220mA; Voltage Rating (DC): 50V; Weight: 0.03g; Continuous Drain Current (ID): 220mA; Number of Pins: 3; Nominal Vgs: 1.3V; Max Power Dissipation: 360mW; Fall Time: 9ns; Drain to Source Resistance: 3.5R; Contact Plating: Tin; Case/Package: SOT-23; Package Quantity: 1; Dual Supply Voltage: 50V; Mount: Surface Mount; Termination: SMD/SMT; Max Operating Temperature: 150°C
R41 R70-R72 = CMP-009-00178-1: Fixed Resistor, Metal Glaze/thick Film, 0.1W, 180ohm, 75V, 5% +/-Tol, 100ppm/Cel, Surface Mount, 0603; Power: 100mW; Tolerance: 5%; Pins: 2; Mounting Technology: Surface Mount; RoHS Compliant: Yes; Max Operating Temperature: 155°C; Min Operating Temperature: -55°C
R42 = CMP-009-00187-1: Fixed Resistor, Metal Glaze/thick Film, 0.1W, 75000ohm, 75V, 1% +/-Tol, 100ppm/Cel, Surface Mount, 0603; Additional Feature: LASER TRIMMABLE; Temperature Coefficient: 100ppm/°C; Package Height: 0.45mm; Rated Temperature: 70°C; Power: 100mW; Package Length: 1.6mm; Package Width: 0.8mm; Max Operating Temperature: 155°C; Technology: METAL GLAZE/THICK FILM; Terminal Finish: Nickel; Packaging: Tape and Reel; Resistor Type: FIXED RESISTOR; Package Style: SMTMeter; Min Operating Temperature: -55°C; Working Voltage: 75V; Pins: 2; Construction: Chip; RoHS Compliant: Yes; Reach SVHC Compliant: Yes; JESD-609 Code: e3; Tolerance: 1%; Mounting Technology: Surface Mount; Termination: Wraparound; Package Shape: Rectangular
R43-R45 R47 R58-R60 R66-R69 R75 R76 R80 R81 = CMP-009-00017-7: Chip Resistor, 10 KOhm, +/- 1%, 01 W, -55 to 155 degC, 0603 (1608 Metric); Voltage Rating: 50V; Power: 100mW; RoHS Compliant: True; Min Operating Temperature: -55°C; Pins: 2; Mounting Technology: SM; Max Operating Temperature: 155°C; Tolerance: 1%
R46 R54 R61 R65 R77 R79 R82 R84 = CMP-009-00199-1: Metal Glaze/thick Film, 0.1W, 0ohm, Surface Mount, 0603; Package Length: 1.6mm; Temperature Coefficient: 100ppm/°C; Working Voltage: 75V; Package Height: 0.45mm; Package Width: 0.8mm; Rated Temperature: 70°C; Tolerance: 1%; Power: 100mW; Additional Feature: LASER TRIMMABLE; RoHS Compliant: Yes; JESD-609 Code: e3; Max Operating Temperature: 155°C; Technology: METAL GLAZE/THICK FILM; Package Style: SMTMeter; Package Shape: Rectangular; Reach SVHC Compliant: Yes; Construction: Chip; Packaging: Tape and Reel; Terminal Finish: Nickel; Termination: Wraparound; Mounting Technology: Surface Mount; Min Operating Temperature: -55°C; Pins: 2; Resistor Type: FIXED RESISTOR
R48 R78 = CMP-00020-1: Resistor Current Sense Metal Film 2512 160mOhm ±1% 1W ±50ppm/°C T/R Automotive; RoHS Compliant: No
R49 = CMP-009-00188-1: Fixed Resistor, Metal Glaze/thick Film, 0.1W, 150000ohm, 75V, 1% +/-Tol, 100ppm/Cel, Surface Mount, 0603; Rated Temperature: 70°C; Package Width: 0.8mm; Package Length: 1.6mm; Package Height: 0.45mm; Additional Feature: LASER TRIMMABLE; Power: 100mW; Temperature Coefficient: 100ppm/°C; Pins: 2; Working Voltage: 75V; Package Style: SMTMeter; Packaging: Tape and Reel; Resistor Type: FIXED RESISTOR; RoHS Compliant: Yes; Package Shape: Rectangular; Min Operating Temperature: -55°C; Terminal Finish: Nickel; Construction: Chip; JESD-609 Code: e3; Termination: Wraparound; Technology: METAL GLAZE/THICK FILM; Mounting Technology: Surface Mount; Reach SVHC Compliant: Yes; Max Operating Temperature: 155°C; Tolerance: 1%
R50 = CMP-009-00198-1: Fixed Resistor, Metal Glaze/thick Film, 0.1W, 16900ohm, 75V, 1% +/-Tol, 100ppm/Cel, Surface Mount, 0603; Package Width: 0.8mm; Package Height: 0.45mm; Voltage Rating: 50V; Temperature Coefficient: 100ppm/°C; Rated Temperature: 70°C; Power: 100mW; Package Length: 1.6mm; Additional Feature: LASER TRIMMABLE; JESD-609 Code: e3; Reach SVHC Compliant: Yes; Mounting Technology: Surface Mount; Max Operating Temperature: 155°C; Min Operating Temperature: -55°C; Resistor Type: FIXED RESISTOR; Terminal Finish: Nickel; Construction: Chip; Technology: METAL GLAZE/THICK FILM; Working Voltage: 75V; Packaging: Tape and Reel; Package Shape: Rectangular; Termination: Wraparound; Pins: 2; Package Style: SMTMeter; Tolerance: 1%; RoHS Compliant: Yes
R53 = CMP-009-00195-1: Fixed Resistor, Metal Glaze/thick Film, 0.1W, 100000ohm, 75V, 1% +/-Tol, 100ppm/Cel, Surface Mount, 0603; Power: 100mW; Voltage Rating: 50V; Package Length: 1.6mm; Package Height: 0.45mm; Rated Temperature: 70°C; Package Width: 0.8mm; Temperature Coefficient: 100ppm/°C; Additional Feature: LASER TRIMMABLE; Pins: 2; Reach SVHC Compliant: Yes; Terminal Finish: Nickel; RoHS Compliant: Yes; Technology: METAL GLAZE/THICK FILM; JESD-609 Code: e3; Working Voltage: 75V; Construction: Chip; Mounting Technology: Surface Mount; Package Style: SMTMeter; Packaging: Tape and Reel; Min Operating Temperature: -55°C; Termination: Wraparound; Tolerance: 1%; Package Shape: Rectangular; Max Operating Temperature: 155°C; Resistor Type: FIXED RESISTOR
R55 = CMP-009-00186-1: Fixed Resistor, Metal Glaze/thick Film, 0.1W, 51000ohm, 75V, 1% +/-Tol, 100ppm/Cel, Surface Mount, 0603; Rated Temperature: 70°C; Package Height: 0.45mm; Temperature Coefficient: 100ppm/°C; Power: 100mW; Package Length: 1.6mm; Package Width: 0.8mm; Additional Feature: LASER TRIMMABLE; Tolerance: 1%; Termination: Wraparound; Technology: METAL GLAZE/THICK FILM; Resistor Type: FIXED RESISTOR; Mounting Technology: Surface Mount; Package Shape: Rectangular; Pins: 2; Max Operating Temperature: 155°C; Package Style: SMTMeter; JESD-609 Code: e3; Reach SVHC Compliant: Yes; Construction: Chip; RoHS Compliant: Yes; Packaging: Tape and Reel; Min Operating Temperature: -55°C; Terminal Finish: Nickel; Working Voltage: 75V
R56 = CMP-009-00196-1: Fixed Resistor, Metal Glaze/thick Film, 0.1W, 24900ohm, 75V, 1% +/-Tol, 100ppm/Cel, Surface Mount, 0603; Temperature Coefficient: 100ppm/°C; Power: 100mW; Package Width: 0.8mm; Voltage Rating: 50V; Additional Feature: LASER TRIMMABLE; Rated Temperature: 70°C; Package Length: 1.6mm; Package Height: 0.45mm; Resistor Type: FIXED RESISTOR; Construction: Chip; Max Operating Temperature: 155°C; Termination: Wraparound; Packaging: Tape and Reel; Tolerance: 1%; Mounting Technology: Surface Mount; Reach SVHC Compliant: Yes; Package Style: SMTMeter; Min Operating Temperature: -55°C; Pins: 2; Package Shape: Rectangular; RoHS Compliant: Yes; Working Voltage: 75V; Technology: METAL GLAZE/THICK FILM; JESD-609 Code: e3; Terminal Finish: Nickel
R57 R64 = CMP-009-00193-2: Fixed Resistor, Metal Glaze/thick Film, 0.1W, 1330ohm, 75V, 1% +/-Tol, 100ppm/Cel, Surface Mount, 0603; Temperature Coefficient: 100ppm/°C; Additional Feature: LASER TRIMMABLE; Voltage Rating: 50V; Rated Temperature: 70°C; Power: 100mW; Package Height: 0.45mm; Package Width: 0.8mm; Package Length: 1.6mm; Tolerance: 1%; Package Shape: Rectangular; Pins: 2; Termination: Wraparound; Packaging: Tape and Reel; Technology: METAL GLAZE/THICK FILM; Package Style: SMTMeter; JESD-609 Code: e3; Construction: Chip; Working Voltage: 75V; RoHS Compliant: Yes; Min Operating Temperature: -55°C; Mounting Technology: Surface Mount; Reach SVHC Compliant: Yes; Terminal Finish: Nickel; Max Operating Temperature: 155°C; Resistor Type: FIXED RESISTOR
R62 R83 = CMP-00018-1: Fixed Resistor, Metal Strip, 1W, 0.025ohm, 0.1581V, 1% +/-Tol, 75ppm/Cel, Surface Mount, 2512; RoHS Compliant: No
R63 = CMP-009-00193-2: Fixed Resistor, Metal Glaze/thick Film, 0.1W, 1330ohm, 75V, 1% +/-Tol, 100ppm/Cel, Surface Mount, 0603; Power: 100mW; Temperature Coefficient: 100ppm/°C; Package Width: 0.8mm; Additional Feature: LASER TRIMMABLE; Voltage Rating: 50V; Rated Temperature: 70°C; Package Height: 0.45mm; Package Length: 1.6mm; Termination: Wraparound; Working Voltage: 75V; Package Style: SMTMeter; Pins: 2; Packaging: Tape and Reel; JESD-609 Code: e3; RoHS Compliant: Yes; Package Shape: Rectangular; Tolerance: 1%; Technology: METAL GLAZE/THICK FILM; Min Operating Temperature: -55°C; Mounting Technology: Surface Mount; Construction: Chip; Reach SVHC Compliant: Yes; Max Operating Temperature: 155°C; Resistor Type: FIXED RESISTOR; Terminal Finish: Nickel
R74 = CMP-009-00189-1: Fixed Resistor, Metal Glaze/thick Film, 0.1W, 100ohm, 75V, 1% +/-Tol, 100ppm/Cel, Surface Mount, 0603; Rated Temperature: 70°C; Package Width: 0.8mm; Package Length: 1.6mm; Package Height: 0.45mm; Additional Feature: LASER TRIMMABLE; Temperature Coefficient: 100ppm/°C; Power: 100mW; Package Shape: Rectangular; Tolerance: 1%; JESD-609 Code: e3; Resistor Type: FIXED RESISTOR; Terminal Finish: Nickel; Max Operating Temperature: 155°C; Reach SVHC Compliant: Yes; Technology: METAL GLAZE/THICK FILM; Mounting Technology: Surface Mount; RoHS Compliant: Yes; Construction: Chip; Packaging: Tape and Reel; Package Style: SMTMeter; Termination: Wraparound; Working Voltage: 75V; Min Operating Temperature: -55°C; Pins: 2
S5 S7 = CMP-011-00017-1: 8.8 X 3.9 X 3.5 Mm, 2 Mm Raised
SW3 = CMP-00028-00008-3: Keypad Switch, 1 Switches, SPST, Momentary, 0.1A, 16VDC, 3.92N, 0 PCB Hole Cnt, Solder Terminal, Surface Mount-straight; Manufacturer Series: 7914; End Contact Material: Stainless Steel; Actuator Angle: 0°; Actuator Length: 0inch; Contact DC Max Rating R Load: .1A@16VDC; Contact Resistance: 0.1mR; Circuit Configuration: 1X1; Center Contact Plating: Gold; Actuator Type: FLUSH TYPE; Insulation Resistance: 100MR; Number of Switches: 1; Contact Timing: SNAP ACTION; Body Height: 2.54mm; Body Breadth: 5inch; Contact Current(DC)-Max: 100mA; Contact Voltage(DC)-Max: 16V; Body Length or Diameter: 5mm; Sealing: WATER PROOF; Dielectric Withstand Volts: 250VACV; Contact Function: N.O.-N.C.; Actuator Material: Rubber; Housing Material: Stainless Steel; Reach SVHC Compliant: Yes; JESD-609 Code: e4; Packaging: Tape and Reel; Max Operating Temperature: 125°C; Min Operating Temperature: -55°C; Insulation Material: Thermoplastic; Mounting Technology: Surface Mount; Switch Type: Keypad; Switch Action: MOMENTARY; Contact Material: Stainless Steel; Terminal Finish: Nickel; Terminal Length: 0inch; Operating Force-Max: 3.92N; Termination: Solder; Switch Function: SPST; End Contact Plating: Gold; Bushing Length: 0inch; Bushing Diameter: 0inch; RoHS Compliant: Yes; Terminal Material: Bronze
TP21-TP29 = CMP-002-00072-5: Test point; Connector Type: Interconnection Device; Pins: 2; Max Operating Temperature: 125°C; Case/Package: 0603; Mounting Technology: Surface Mount; RoHS Compliant: Yes; Min Operating Temperature: -55°C
U3 = CMP-019-00051-3: Switching Regulator, 12A, 1200kHz Switching Freq-Max, PQCC18; Nominal Supply Voltage: 12V; Min Input Voltage: 4.5V; Channels: 1; Package Body Material: Plastic; Switcher Configuration: BUCK; Frequency: 1.2MHz; Max Supply Voltage: 17V; Control Technique: PULSE WIDTH MODULATION; Pins: 18; Temperature Grade: AUTOMOTIVE; Length: 3.5mm; Terminal Form: No Lead; Terminal Position: QUAD; Min Operating Temperature: -40°C; Moisture Sensitivity Level: 2; Reach SVHC Compliant: Yes; Case/Package: QCCN; Package Shape: Square; Height - Seated (Max): 1mm; Width: 3.5mm; Surface Mount: Yes; Package Style: CHIP CARRIERMeter; Throw Configuration: SWITCHING REGULATOR; RoHS Compliant: Yes; Max Operating Temperature: 125°C
U4 U6 U8 U9 = CMP-0704-00041-3: IC CURRENT MONITOR 1% SOT23-8; Common Mode Rejection Ratio: 100dB; Bandwidth: 3.4MHz; Operating Supply Current: 1mA; Nominal Supply Current: 700uA; Min Input Voltage: 0V; Output Current per Channel: 10mA; Number of Amplifiers: 1; Input Offset Voltage (Vos): 100uV; Max Input Voltage: 26V; Min Supply Voltage: 3V; Max Supply Current: 5mA; Max Supply Voltage: 5.5V; Output Type: Digital; Accuracy: 1%; Radiation Hardening: No; Min Operating Temperature: -40°C; Contact Plating: Gold; REACH SVHC: No SVHC; Packaging: Tape and Reel; Max Operating Temperature: 125°C; Lead Free: Lead Free; Weight: 0.001411oz; Supply Current: 700uA; Number of Pins: 8; Length: 3mm; Quiescent Current: 700uA; Features: I²C; Height: 1.3mm; Output Current: 10mA; Case/Package: SOT-23-8; RoHS Compliant: Yes; Width: 1.75mm; Package Quantity: 3000; Series: Zero-Drift
U5 = CMP-005-00016-4: IC ELECTRONIC FUSE 32QFN; Case/Package: 32QFN
U7 = CMP-019-00050-1: Fixed Positive LDO Regulator, 3.3V, 0.7V Dropout, CMOS, PDSO4; Dropout Voltage1-Nom: 455mV; Input Voltage Absolute-Max: 6V; Channels: 1; Voltage Tolerance-Max: 2%; Package Body Material: Plastic; Output Current1-Max: 1A; Load Regulation-Max: 0.035%; Regulator Type: FIXED POSITIVE SINGLE OUTPUT LDO REGULATOR; Max Supply Voltage: 5.5V; Output Voltage1-Max: 3.3495V; Min Input Voltage: 2V; Qualification Status: Not Qualified; Dropout Voltage1-Max: 700mV; Output Voltage1-Min: 3.2505V; Height - Seated (Max): 1.8mm; Packaging: Tape and Reel; Width: 3.5mm; Operating Temperature, TJ-Max: 125°C; Package Shape: Rectangular; Technology: CMOS; Case/Package: SOP; Length: 6.5mm; Adjustability: FIXED; Number of Outputs: 1; Terminal Finish: Tin; Output Voltage1-Nom: 3.3V; Package Style: SMALL OUTLINEMeter; Terminal Position: DUAL; Reach SVHC Compliant: Yes; Surface Mount: Yes; Terminal Pitch: 2.3mm; JESD-30 Code: R-PDSO-G3; Pins: 3; Moisture Sensitivity Level: 1; Peak Reflow Temperature (Cel): 260°C; Operating Temperature, TJ-Min: -40°C; JESD-609 Code: e3; RoHS Compliant: Yes; Terminal Form: Gull Wing